# Altium schematic sheet CAN.SchDoc
size A; SheetNumber: 5; SheetTotal: 11
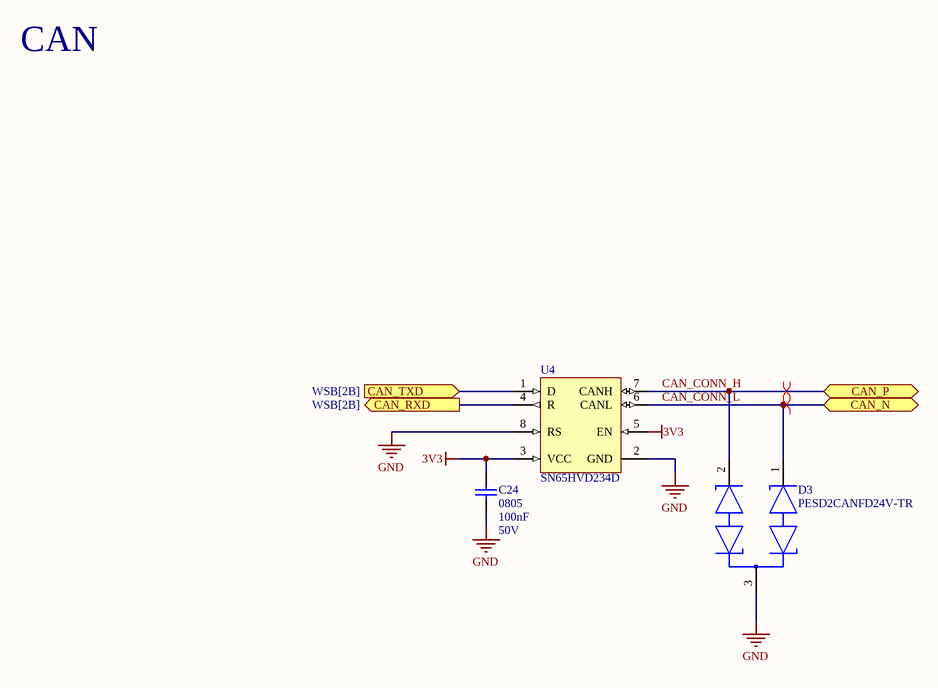
[diagram p0: CAN.SchDoc]

## Parts
C24  Case Code (Imperial): 0805  Capacitance: 100nF  Voltage Rating: 50V  [CAPC2013X88X50NL20T25]  (hidden comment: C0805C104K5RACTU)
D3  PESD2CANFD24V-TR  [FP-SOT23-IPC_A]
U4  SN65HVD234D  [D0008A_M]

## Ports
CAN_N (bidir, see WSB[2B]), CAN_P (bidir, see WSB[2B]), CAN_RXD (out, see WSB[2B]), CAN_TXD (in, see WSB[2B])

## Nets
3V3: C24.1 U4.3(VCC) U4.5(EN)
GND: C24.2 D3.3(CC) U4.2(GND) U4.8(RS)
CAN_CONN_H: D3.2(K2) U4.7(CANH) ; port CAN_P
CAN_CONN_L: D3.1(K1) U4.6(CANL) ; port CAN_N
CAN_RXD: U4.4(R) ; port CAN_RXD
CAN_TXD: U4.1(D) ; port CAN_TXD

## Layout directives
differential pair: CAN_CONN_H, CAN_CONN_L

## Notes on the sheet
- CAN

## Library data of the parts
C24 = CMP-2007-00279-1: Manufacturer: Kemet; Dielectric Material: Ceramic; Tolerance: 10%; Dielectric: X7R; Voltage: 500V; Part Number: C0805C104K5RACTU; Supplier 1: Digi-Key; Supplier Part Number 1: 399-1170-1-ND; Manufacturer Part Number: C0805C104K5RACTU; Stock 1: 1913908; Pricing 1: 1 = 0.23000, 10 = 0.16600, 100 = 0.07800, 500 = 0.05472, 1000 = 0.04530 (USD); RoHS: Yes; Mount: Surface Mount; Case/Package: 0805; Number of Pins: 2; Case Code (Metric): 2012; Contact Plating: Tin; Min Operating Temperature: -55°C; Max Operating Temperature: 125°C; Packaging: Tape and Reel; Voltage Rating (DC): 50V; Package Quantity: 1; Termination: SMD/SMT; Length: 2mm; Height: 0.9mm; Depth: 1.25mm; Width: 1.2mm; Thickness: 0.035inch; Lead Pitch: 0.75mm; Radiation Hardening: No; REACH SVHC: No SVHC; ComponentLink1URL: https://datasheet.ciiva.com/14589/70095383-14589048.pdf?src-supplier=Allied+Electronics; ComponentLink1Description: https://datasheet.ciiva.com/14589/70095383-14589048.pdf?src-supplier=Allied+Electronics; ComponentLink2URL: https://datasheet.ciiva.com/28682/1851736-28682232.pdf?src-supplier=Element14; ComponentLink2Description: https://datasheet.ciiva.com/28682/1851736-28682232.pdf?src-supplier=Element14; ComponentLink3URL: https://datasheet.ciiva.com/32431/slceramic-chip-condensers-e-32431755.pdf?src-supplier=Distrelec; ComponentLink3Description: https://datasheet.ciiva.com/32431/slceramic-chip-condensers-e-32431755.pdf?src-supplier=Distrelec; ComponentLink4URL: https://datasheet.ciiva.com/18410/70095383-18410815.pdf?src-supplier=Allied+Electronics; ComponentLink4Description: https://datasheet.ciiva.com/18410/70095383-18410815.pdf?src-supplier=Allied+Electronics
D3 = CMP-14436-000014-1: TVS DIODE 24VWM 42VC TO236AB
U4 = CMP-0315-00083-2: 3.3V CAN Transceiver with Sleep Mode, 6 mA, -40 to 125 degC, 8-pin SOIC (D), Green (RoHS & no Sb/Br); Manufacturer: Texas Instruments; Rating: Catalog; Receivers Per Package: 1; Bus Fault Voltage(V): +/-30; Transient Pulse Protection(V): -100 to 100; ICC(Max)(mA): 6; Supply Voltage(s)(V): 3.3; DatasheetVersion: SLLS557F; PackageVersion: revM, Jun-2011; Eco-Plan: Green (RoHS & no Sb/Br); PackageReference: D0008A; Drivers Per Package: 1; SubFamily: CAN; Code_JEDEC: MS-012AA; Isolated: No; ComponentLink1URL: http://www.ti.com/general/docs/lit/getliterature.tsp?genericPartNumber=SN65HVD234&fileType=pdf; Mounting Technology: Surface Mount; PackageDescription: 8-Pin Plastic Small Outline Integrated Circuit, 4.9 x 3.9 mm, Pitch 1.27 mm Pitch; PartNumber: SN65HVD234D; Footprint: PCA82C250, excludes pin5; Low Power Mode: Sleep; ComponentLink1Description: Datasheet